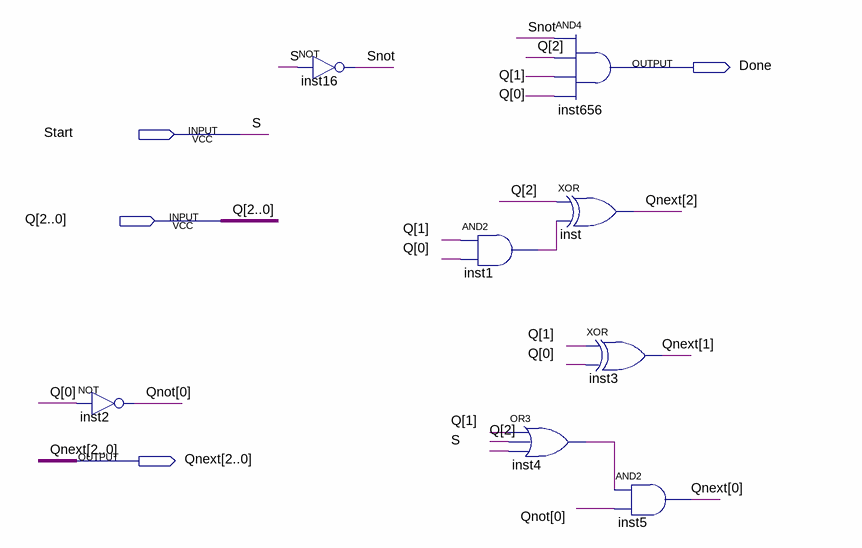
[diagram p0: schematic sheet]
// Quartus schematic Next_State_3.bdf as structural Verilog: 8 symbols, 4 pins
module Next_State_3 (
  input  Start,
  input  [2:0] Q,
  output Done,
  output [2:0] Qnext
);

  wire inst1_out, inst4_out, Snot;
  wire [0:0] Qnot;

  not inst2 (Qnot[0], Q[0]);
  not inst16 (Snot, Start);
  and inst1 (inst1_out, Q[1], Q[0]);
  and inst656 (Done, Snot, Q[2], Q[1], Q[0]);
  xor inst (Qnext[2], Q[2], inst1_out);
  or inst4 (inst4_out, Q[1], Q[2], Start);
  xor inst3 (Qnext[1], Q[1], Q[0]);
  and inst5 (Qnext[0], inst4_out, Qnot[0]);

  // Other names for the same wires on the sheet: S = Start
endmodule
